# Altium schematic sheet eBox_3G_Diagram.schdoc: car_logger_fona_diagram
size A4; DocumentNumber: 1; SheetNumber: 1; SheetTotal: 3
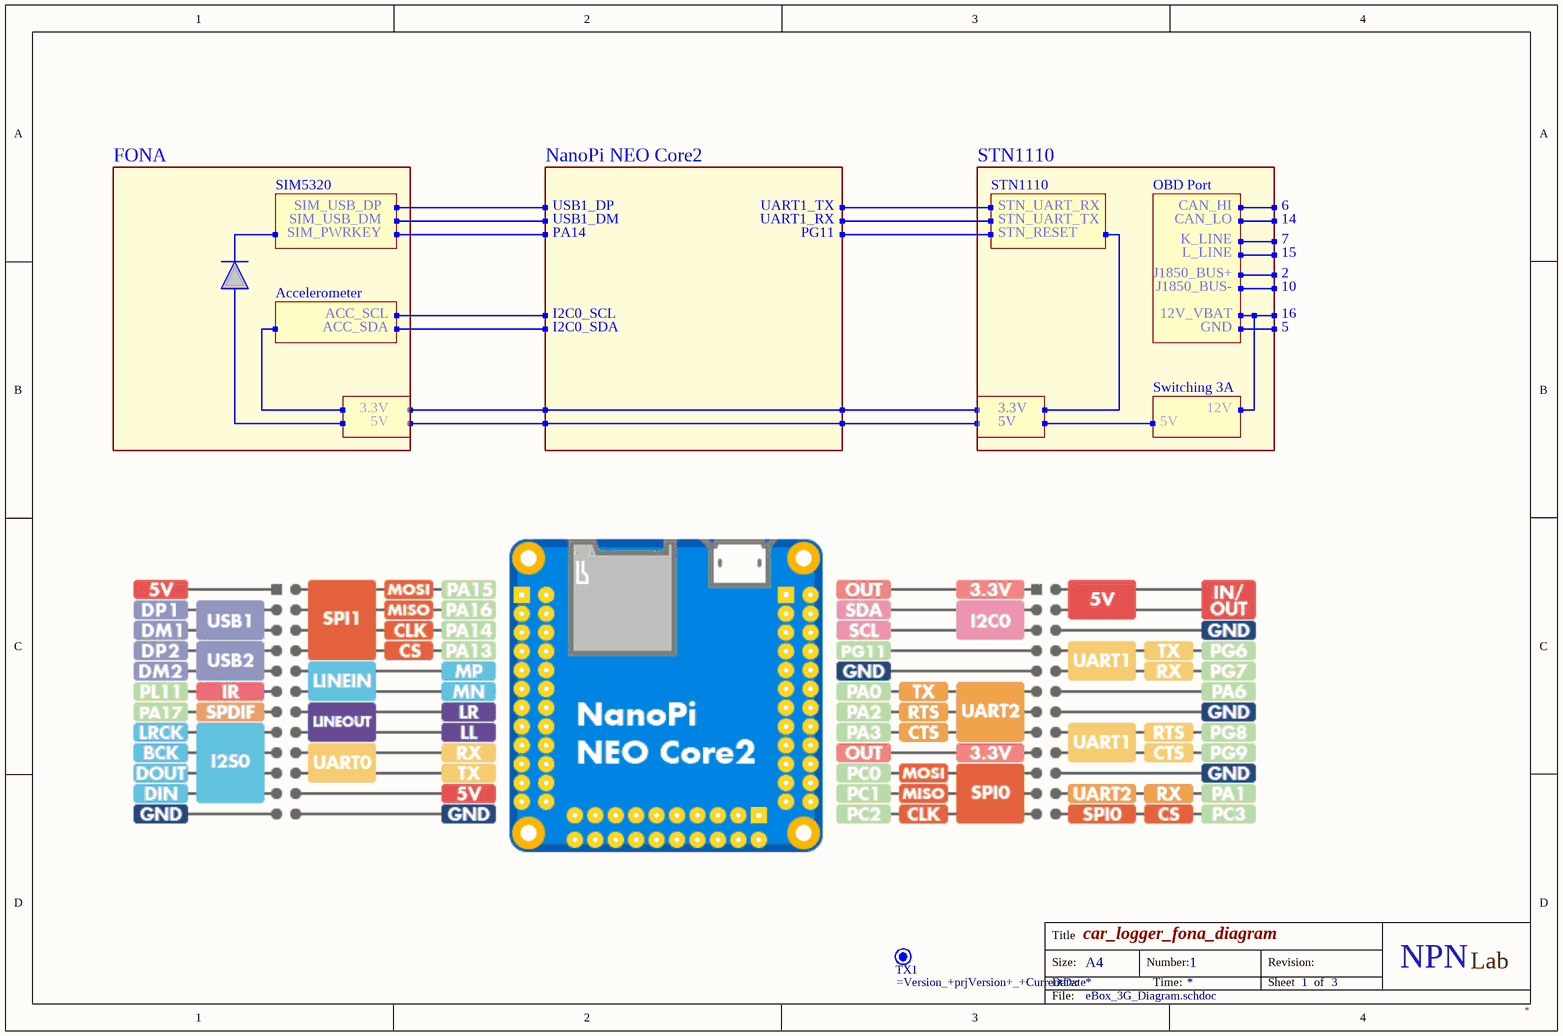
[diagram p0: eBox_3G_Diagram.schdoc]

## Parts
TX1  (no value)  [TEXT]  (no BOM)

## Notes on the sheet
- FONA
- NanoPi NEO Core2
- STN1110
- SIM5320
- SIM_USB_DP
- SIM_USB_DM
- SIM_PWRKEY
- USB1_DP
- PA14
- USB1_DM
- UART1_TX
- UART1_RX
- PG11
- STN_UART_TX
- STN_UART_RX
- STN_RESET
- OBD Port
- CAN_HI
- CAN_LO
- K_LINE
- 6
- 14
- 7
- Accelerometer
- L_LINE
- J1850_BUS-
- J1850_BUS+
- 15
- 10
- 2
- ACC_SCL
- ACC_SDA
- I2C0_SCL
- I2C0_SDA
- GND
- 12V_VBAT
- 16
- 5
- 5V
- 3.3V
- Switching 3A
- 12V
- Title
- Size:
- Date:
- A4
- Number:
- Time:
- Revision:
- Sheet
- of
- NPN
- Lab
- File:

## Library data of the parts
TX1 = Text